# EAGLE design ButtonBoardCharlie (EAGLE 5.11)
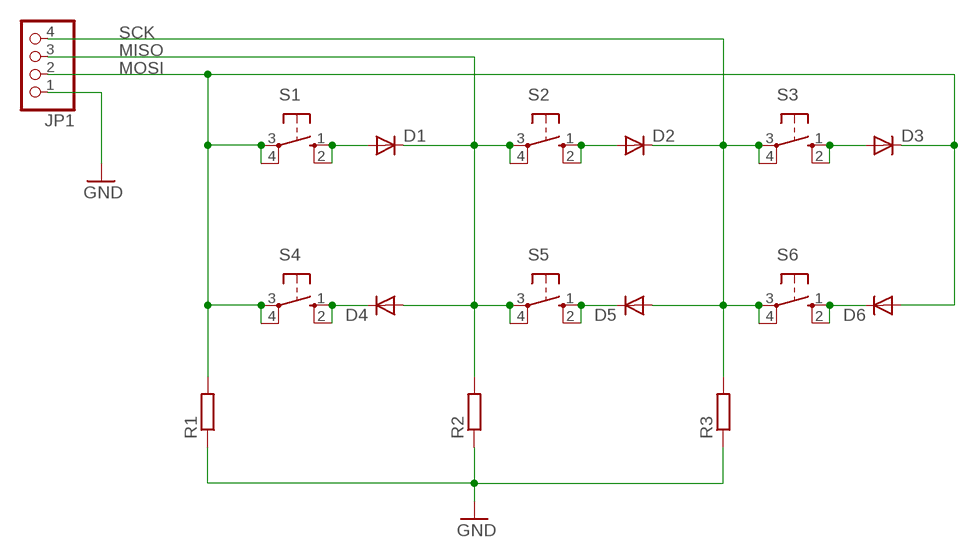
[diagram p0: schematic, sheet 1]

## Parts
D1  DIODE-SOD323-R  [SOD323-R]
D2  DIODE-SOD323-R  [SOD323-R]
D3  DIODE-SOD323-R  [SOD323-R]
D4  DIODE-SOD323-R  [SOD323-R]
D5  DIODE-SOD323-R  [SOD323-R]
D6  DIODE-SOD323-R  [SOD323-R]
JP1  PINHD-1X4  [1X04]
R1  R-EU_R0805  [R0805]
R2  R-EU_R0805  [R0805]
R3  R-EU_R0805  [R0805]
S1  10-XX  [B3F-10XX]
S2  10-XX  [B3F-10XX]
S3  10-XX  [B3F-10XX]
S4  10-XX  [B3F-10XX]
S5  10-XX  [B3F-10XX]
S6  10-XX  [B3F-10XX]

## Nets
GND: JP1.1 R1.1 R2.1 R3.1
MISO: D1.C D4.A JP1.3 R2.2 S2.3(P) S2.4(P1) S5.3(P) S5.4(P1)
MOSI: D3.C D6.A JP1.2 R1.2 S1.3(P) S1.4(P1) S4.3(P) S4.4(P1)
N$2: D1.A S1.1(S) S1.2(S1)
N$4: D2.A S2.1(S) S2.2(S1)
N$5: D3.A S3.1(S) S3.2(S1)
N$6: D4.C S4.1(S) S4.2(S1)
N$7: D5.C S5.1(S) S5.2(S1)
N$8: D6.C S6.1(S) S6.2(S1)
SCK: D2.C D5.A JP1.4 R3.2 S3.3(P) S3.4(P1) S6.3(P) S6.4(P1)

## Library data of the parts
D1-D6 = diode:DIODE-: DIODE
JP1 = pinhead:PINHD-1X4: PIN HEADER
R1-R3 = rcl:R-EU_: RESISTOR, European symbol
S1-S6 = switch-omron:10-XX: OMRON SWITCH; MPN: B3F-1000; OC_FARNELL: 176432; OC_NEWARK: 36M3542

## Board
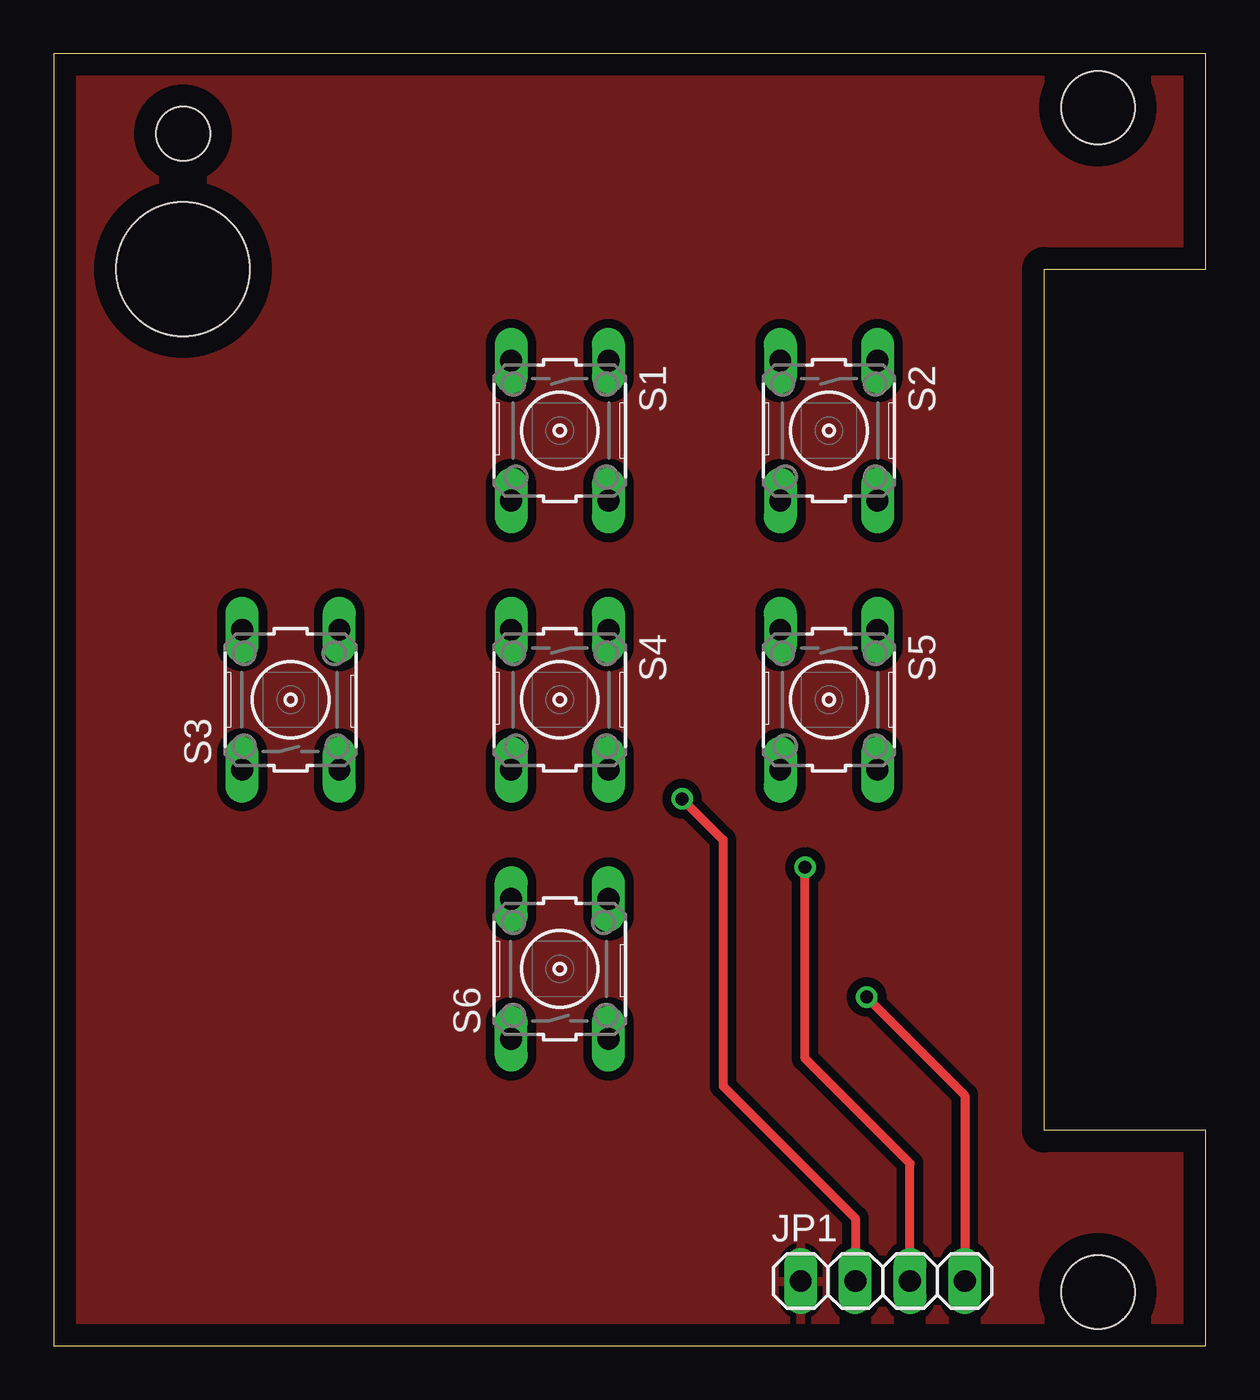
[diagram p1: board, top side]
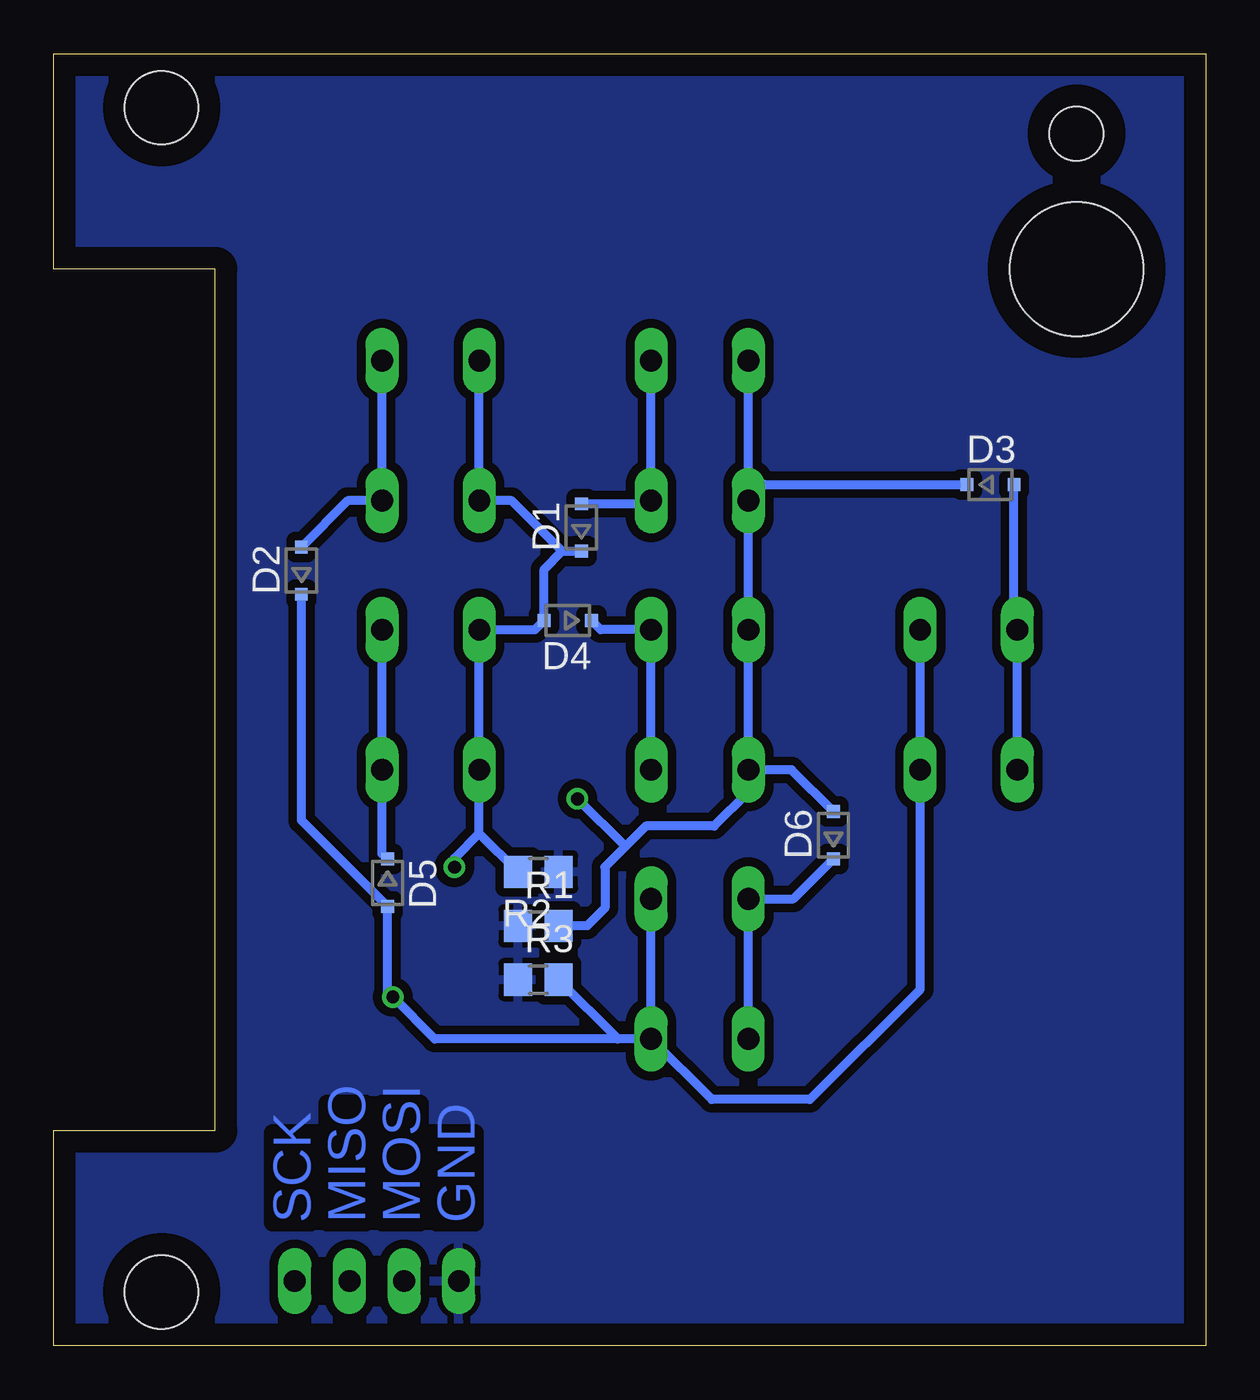
[diagram p2: board, bottom side, seen from below]

Size 53.5 x 60 mm. Coordinates in mm from the lower left corner, seen from the top.
Outline: 0,0 53.5,0 53.5,10 46,10 46,50 53.5,50 53.5,60 0,60 0,0
Copper layers (1*16): Top 0.035mm / dielectric 1.5mm / Bottom 0.035mm
Design rules "default *": minimum track width 10mil, minimum drill 0.6mm, track to track 8mil, track to pad 8mil, pad to pad 8mil, via to via 8mil, smd to smd 8mil, copper to edge 40mil, drill to drill 8mil, minimum pad ring 10mil, minimum via ring 8mil, stop-mask expansion 4mil, vias tented up to drill 0mil, thermal gap 10mil
Holes 3.4 mm at 48.5,57.5 48.5,2.5
Holes 6.2 mm at 6,50
Holes 2.5 mm at 6,56.3

### Footprints (pad centres in the part's own frame; a part is rotated, then mirrored left to right if it is on the bottom)
SOD323-R = smd 0.6 x 0.6: A 1.1,0; C -1.1,0
1X04 = drill 1.016 long: 1 -3.81,0; 2 -1.27,0; 3 1.27,0; 4 3.81,0
R0805 = smd 1.3 x 1.5: 1 -0.95,0; 2 0.95,0
B3F-10XX = drill 1.016 long: 1 -3.251,2.261; 2 3.251,2.261; 3 -3.251,-2.261; 4 3.251,-2.261

### Placement (x,y rotation side)
D1  29,38 90 bottom
D2  42,36 90 bottom
D3  10,40 0 bottom
D4  29.63,33.67 180 bottom
D5  38,21.5 270 bottom
D6  17.29,23.71 90 bottom
JP1  38.5,3 0 top
R1  31,19.5 0 bottom
R2  31,22 180 bottom
R3  31,17 0 bottom
S1  23.5,42.5 270 top
S2  36,42.5 270 top
S3  11,30 90 top
S4  23.5,30 270 top
S5  36,30 270 top
S6  23.5,17.5 90 top

### Tracks (layer width: path | path; a pad name or v marks a point on that pad's centre or on a via)
GND
  pour Top (isolate 0.406): 46,50 53.5,50 53.5,60 0,60 0,0 53.5,0 53.5,10 46,10
  pour Bottom (isolate 0.406): 53.5,60 53.5,50 46,50 46,10 53.5,10 53.5,0 0,0 0,60
MISO  (via drill 0.6)
  Top 0.406: JP1.3 39.77,8.46 34.9,13.34 v34.9,22.23
  Bottom 0.406: S2.3 S2.4 32.23,39.25 29.89,36.9 | 29.89,36.9 D1.C | 29.89,36.9 30.73,36.05 D4.A 31.15,33.25 S5.3 S5.4 33.74,23.79 | 33.74,23.79 R2.2 | v34.9,22.23 34.9,22.63 33.74,23.79
MOSI  (via drill 0.6)
  Top 0.406: JP1.2 37.23,5.92 31.09,12.06 31.09,23.5 v29.18,25.4
  Bottom 0.406: D3.C 20.49,40 S1.4 | S1.4 S1.3 | S1.4 S4.3 S4.4 | S4.4 19.23,26.75 D6.A | S4.4 21.24,25.72 22.83,24.13 26,24.13 26.96,23.18 | 26.96,23.18 27.91,22.23 27.91,20.32 28.73,19.5 R1.2 | 26.96,23.18 v29.18,25.4
N$2
  Bottom 0.406: D1.A 25.91,39.1 S1.2 S1.1
N$4
  Bottom 0.406: D2.A 39.85,39.25 S2.2 S2.1
N$5
  Bottom 0.406: D3.A 8.9,33.41 S3.2 S3.1
N$6
  Bottom 0.406: S4.2 S4.1 28.11,33.25 D4.C
N$7
  Bottom 0.406: S5.1 S5.2 38.26,22.86 D5.C
N$8
  Bottom 0.406: D6.C 19.15,20.75 S6.2 S6.1
SCK  (via drill 0.6)
  Top 0.406: JP1.4 42.31,11.63 v37.75,16.19
  Bottom 0.406: S3.4 S3.3 13.26,16.55 18.39,11.43 22.94,11.43 S6.3 | S6.3 S6.4 | S6.3 27.3,14.25 | 27.3,14.25 R3.2 | 38,16.51 38,16.44 v37.75,16.19 | 38,16.51 D5.A 42,24.4 D2.C | v37.75,16.19 35.81,14.25 27.3,14.25 | v37.75,16.19 37.75,16.26 38,16.51

### Text on the board
Bottom: GND | MOSI | MISO | SCK